# Altium schematic sheet Motors_Sheet.SchDoc
size A
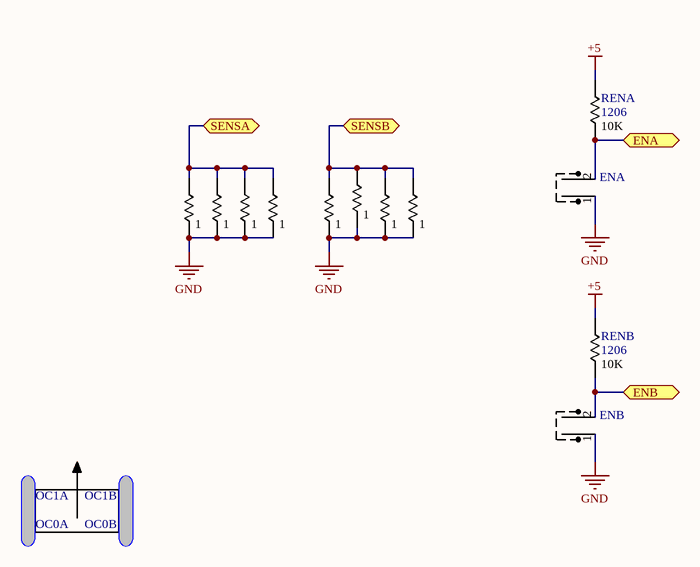
[diagram p0: Motors_Sheet.SchDoc]

## Parts
ENA  jumper  [JUMPER2]  (value not drawn)
ENB  jumper  [JUMPER2]  (value not drawn)
RENA  1206  value 10K  [1206]
RENB  1206  value 10K  [1206]
RS1  value 1  [1206]  (hidden comment: 1206)
RS2  value 1  [1206]  (hidden comment: 1206)
RS3  value 1  [1206]  (hidden comment: 1206)
RS4  value 1  [1206]  (hidden comment: 1206)
RS5  value 1  [1206]  (hidden comment: 1206)
RS6  value 1  [1206]  (hidden comment: 1206)
RS7  value 1  [1206]  (hidden comment: 1206)
RS8  value 1  [1206]  (hidden comment: 1206)

## Ports
ENA (bidir), ENB (bidir), SENSA (bidir), SENSB (bidir)

## Nets
+5: RENA.2 RENB.2
GND: ENA.1 ENB.1 RS1.1 RS2.1 RS3.1 RS4.1 RS5.1 RS6.1 RS7.1 RS8.1
ENA: ENA.2 RENA.1 ; port ENA
ENB: ENB.2 RENB.1 ; port ENB
SENSA: RS1.2 RS2.2 RS3.2 RS4.2 ; port SENSA
SENSB: RS5.2 RS6.2 RS7.2 RS8.2 ; port SENSB

## Notes on the sheet
- OC1A
- OC0A
- OC1B
- OC0B

## Library data of the parts
ENA ENB = Jumper_2